# EAGLE design Dummy (EAGLE 7.3.0)
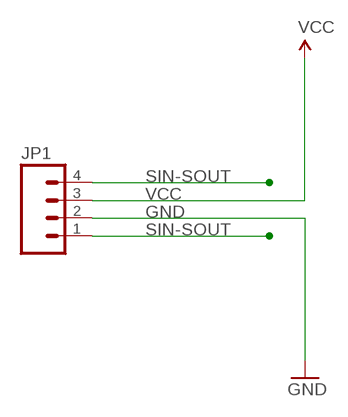
[diagram p0: schematic, sheet 1]

## Parts
JP1  M04PTH  [1X04]

## Nets
GND: JP1.2
SIN-SOUT: JP1.1 JP1.4
VCC: JP1.3

## Library data of the parts
JP1 = SparkFun-Connectors:M04: Header 4 Standard 4-pin 0.1" header. Use with straight break away headers (SKU : PRT-00116), right angle break away headers (PRT-00553), swiss pins (PRT-00743), machine pins (PRT-00117), and female headers (PRT-00115). Molex polarized connector foot print use with SKU : PRT-08231 with associated crimp pins and housings. 1MM SMD Version SKU: PRT-10208

## Board
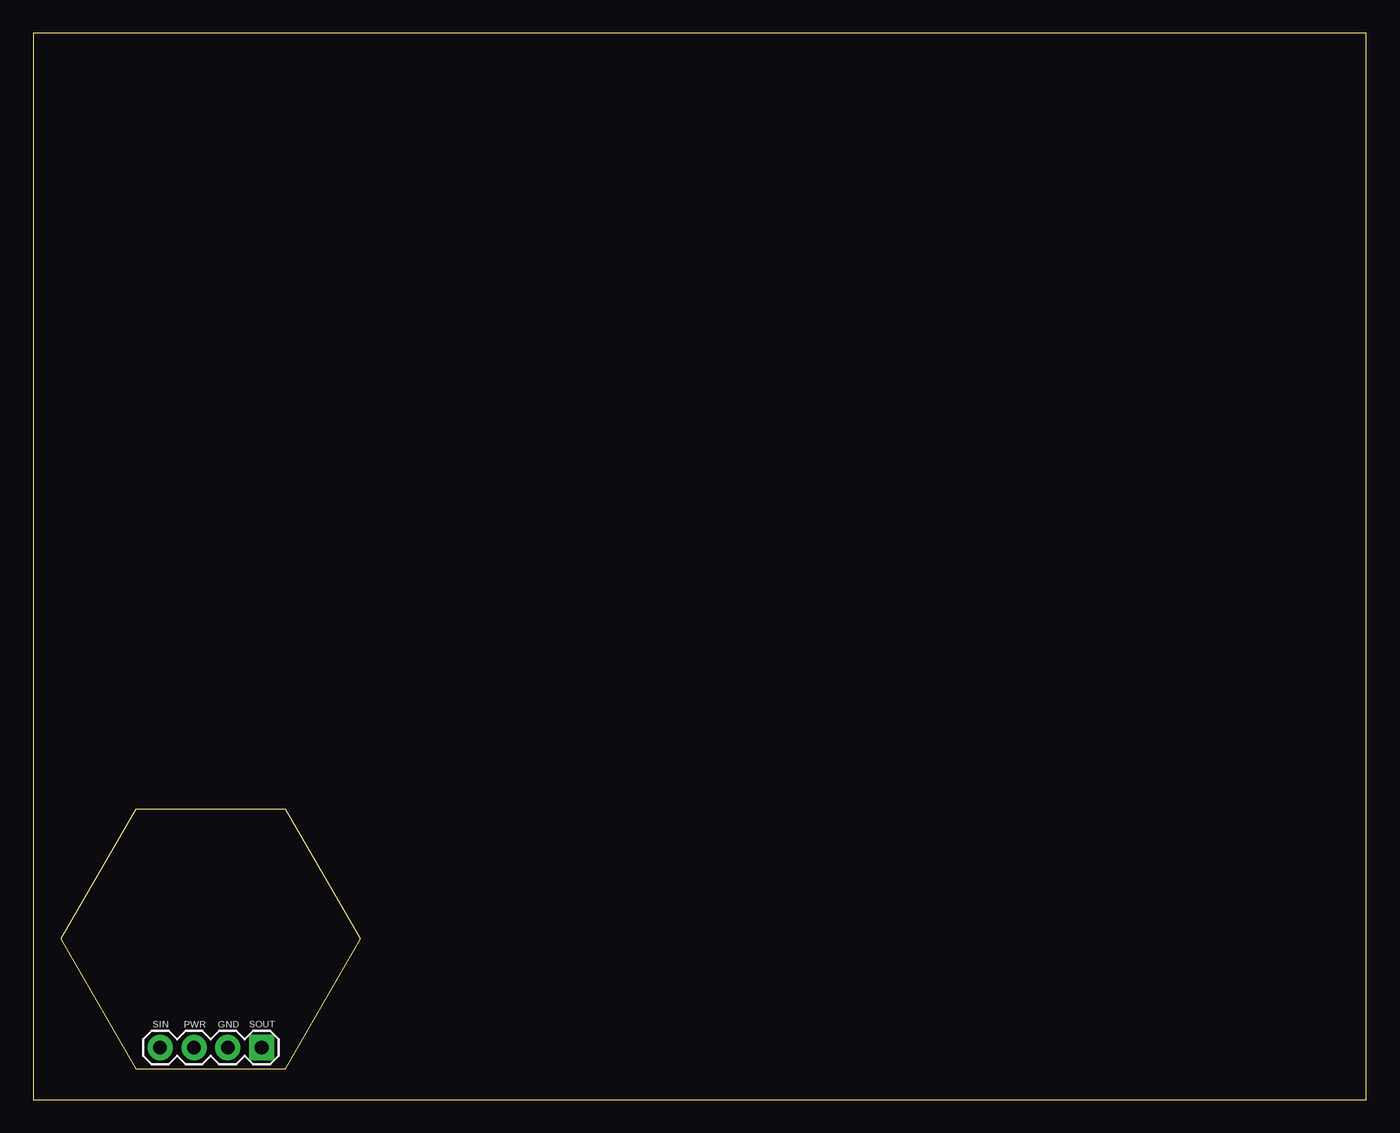
[diagram p1: board, top side]
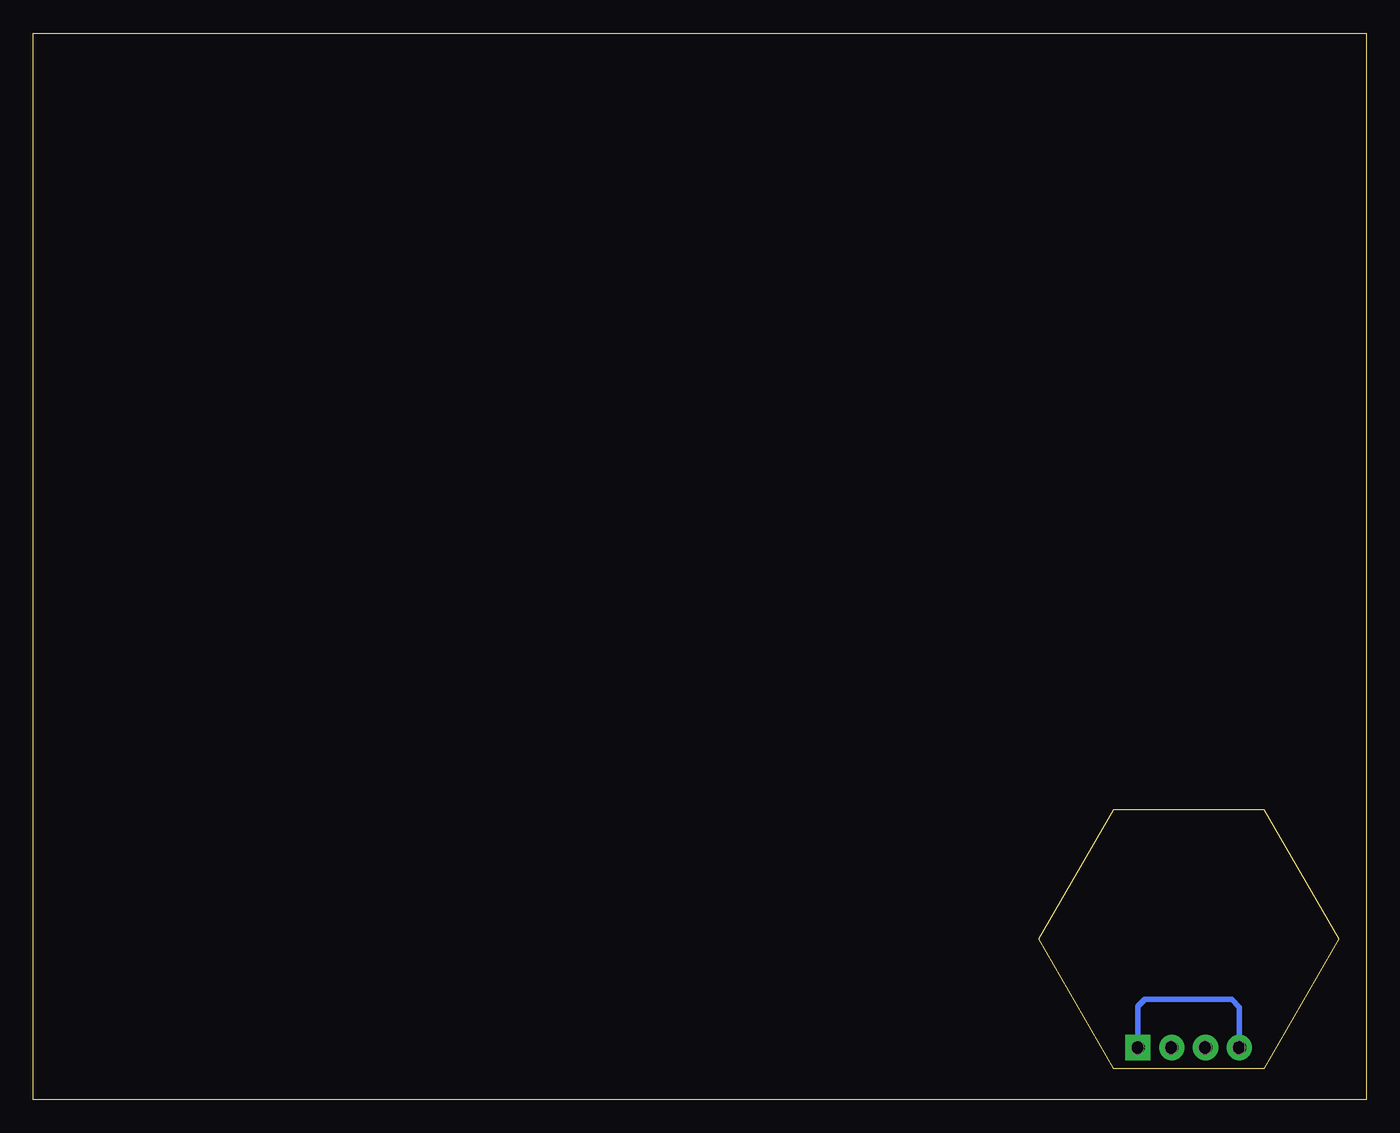
[diagram p2: board, bottom side, seen from below]

Size 100 x 80 mm. Coordinates in mm from the lower left corner, seen from the top.
Outline: 0,0 100,0 100,80 0,80 0,0
Outline: 7.69,2.3 18.94,2.3 24.56,12.04 18.94,21.78 7.69,21.78 2.06,12.04 7.69,2.3
Copper layers (1*16): Top 0.035mm / dielectric 1.5mm / Bottom 0.035mm
Design rules "default *": minimum track width 10mil, minimum drill 24mil, track to track 8mil, track to pad 8mil, pad to pad 8mil, via to via 8mil, smd to smd 8mil, copper to edge 0mil, drill to drill 8mil, minimum pad ring 10mil, minimum via ring 8mil, stop-mask expansion 4mil, vias tented up to drill 0mil, thermal gap 10mil

### Footprints (pad centres in the part's own frame; a part is rotated, then mirrored left to right if it is on the bottom)
1X04 = drill 1.016 pad 1.88 square: 1 0,0 | drill 1.016 pad 1.88: 2 2.54,0; 3 5.08,0; 4 7.62,0

### Placement (x,y rotation side)
JP1  17.13,3.9 180 top

### Tracks (layer width: path | path; a pad name or v marks a point on that pad's centre or on a via)
GND
  Bottom 0.305: 14.55,3.94 JP1.2
SIN-SOUT
  Bottom 0.406: JP1.4 9.51,6.93 10.1,7.52 16.6,7.52 17.14,6.98 JP1.1

### Text on the board
tPlace: SIN | PWR | GND | SOUT